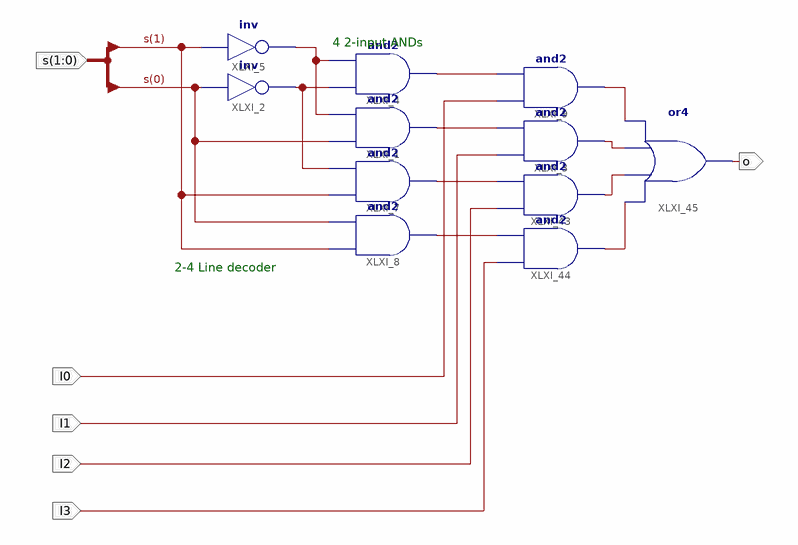
[diagram p0: schematic sheet 1]
// Xilinx ISE schematic MUX4T1.sch (spartan3) as structural Verilog: 11 symbols, 6 ports
module MUX4T1 (
  input  [1:0] s,
  input  I3,
  input  I2,
  input  I1,
  input  I0,
  output o
);

  wire D0, D1, D2, D3, XLXN_80, XLXN_108, XLXN_149, XLXN_150, XLXN_151, XLXN_152;

  and XLXI_4 (D0, XLXN_108, XLXN_80);
  and XLXI_1 (D1, s[0], XLXN_80);
  and XLXI_7 (D2, s[1], XLXN_108);
  and XLXI_8 (D3, s[1], s[0]);
  not XLXI_2 (XLXN_108, s[0]);
  not XLXI_5 (XLXN_80, s[1]);
  and XLXI_9 (XLXN_149, I0, D0);
  and XLXI_3 (XLXN_150, I1, D1);
  and XLXI_43 (XLXN_151, I2, D2);
  and XLXI_44 (XLXN_152, I3, D3);
  or XLXI_45 (o, XLXN_152, XLXN_151, XLXN_150, XLXN_149);

  // Notes on the sheet:
  //   4 2-input ANDs
  //   2-4 Line decoder
endmodule
